# EAGLE design mod.A (EAGLE 7.5.0)
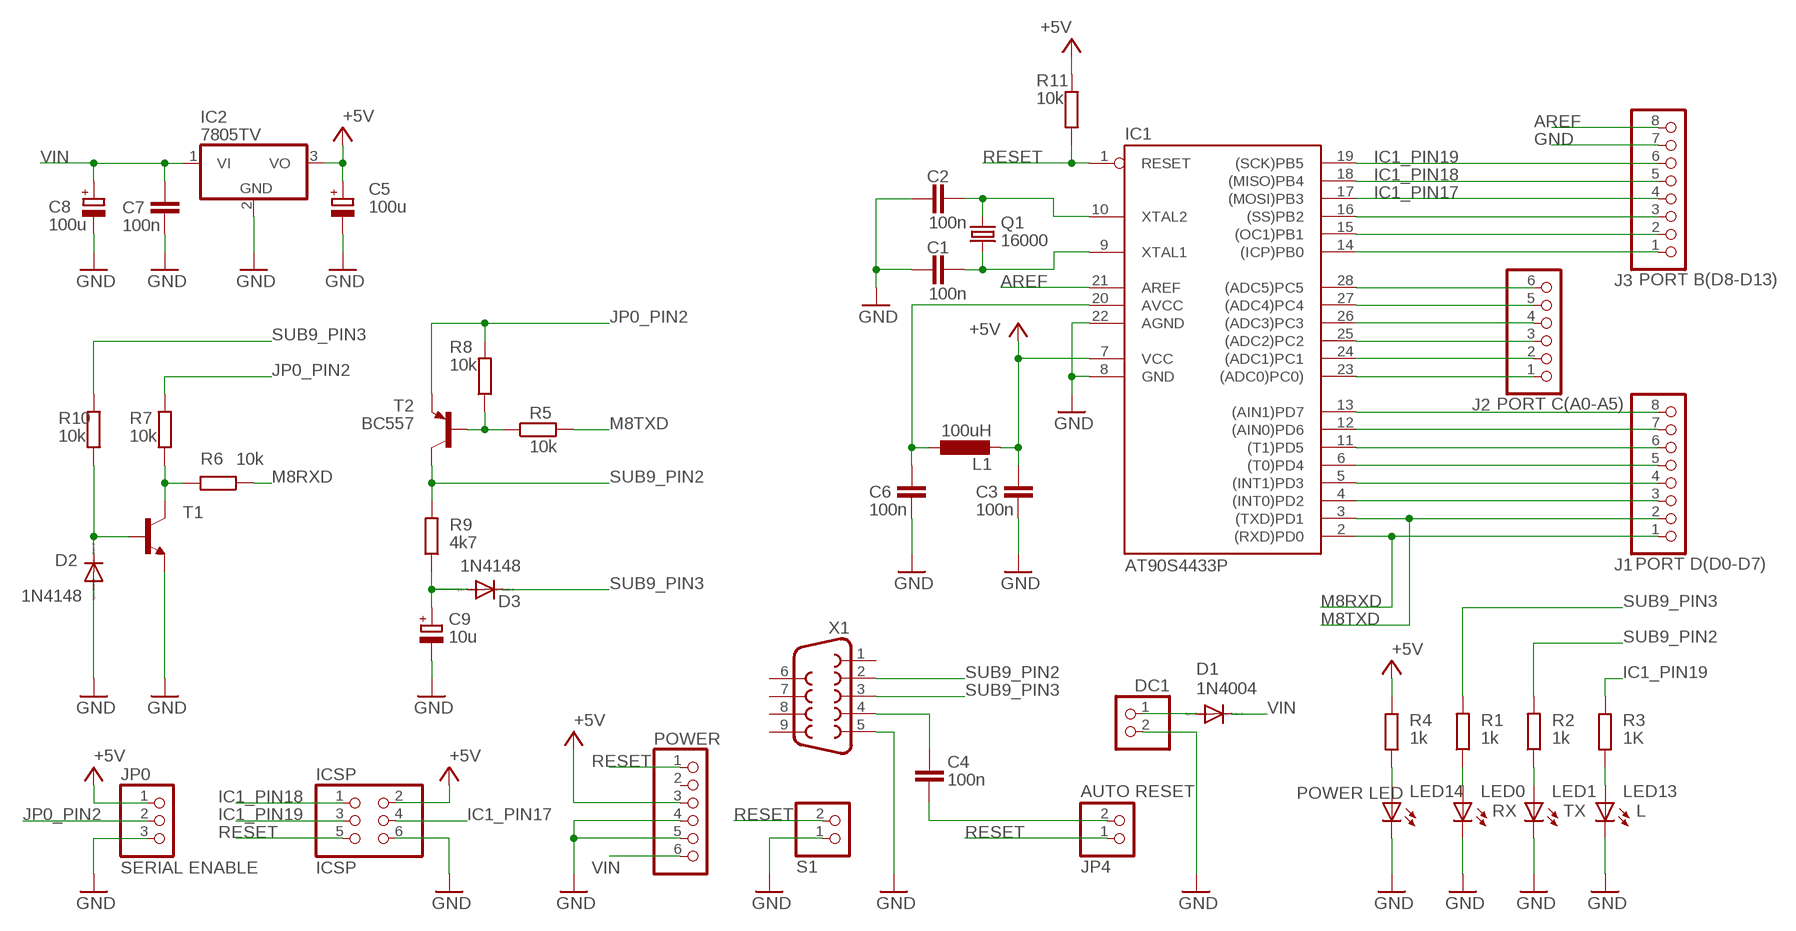
[diagram p0: schematic, sheet 1]

## Parts
C1  100n  C-EUC1206  [C1206]
C2  100n  C-EUC1206  [C1206]
C3  100n  C-EUC1206  [C1206]
C4  100n  C-EUC1206  [C1206]
C5  100u  CPOL-EUE5-8.5  [E5-8,5]
C6  100n  C-EUC1206  [C1206]
C7  100n  C-EUC1206  [C1206]
C8  100u  CPOL-EUE5-8.5  [E5-8,5]
C9  10u  CPOL-EUSMCB  [SMC_B]
D1  1N4004  [DO41-10]
D2  1N4148  1N4148DO35-10  [DO35-10]
D3  1N4148  1N4148DO35-10  [DO35-10]
DC1  PINHD-1X2  [1X02]
IC1  AT90S4433P  [DIL28-3]
IC2  7805TV  [TO220V]
ICSP  ICSP  PINHD-2X3  [2X03]
J1  PORT D(D0-D7)  PINHD-1X8  [1X08]
J2  PORT C(A0-A5)  PINHD-1X6  [1X06]
J3  PORT B(D8-D13)  PINHD-1X8  [1X08]
JP0  SERIAL ENABLE  PINHD-1X3  [1X03]
JP4  AUTO RESET  PINHD-1X2  [1X02]
L1  100uH  L-EUL1812  [L1812]
LED0  RX  LED3MM  [LED3MM]
LED1  TX  LED3MM  [LED3MM]
LED13  L  LED3MM  [LED3MM]
LED14  POWER LED  LED3MM  [LED3MM]
POWER  PINHD-1X6  [1X06]
Q1  16000  CRYSTALHC18U-V  [HC18U-V]
R1  1k  R-EU_R1206  [R1206]
R2  1k  R-EU_R1206  [R1206]
R3  1K  R-EU_R1206  [R1206]
R4  1k  R-EU_R1206  [R1206]
R5  10k  R-EU_R1206  [R1206]
R6  10k  R-EU_R1206  [R1206]
R7  10k  R-EU_R1206  [R1206]
R8  10k  R-EU_R1206  [R1206]
R9  4k7  R-EU_R1206  [R1206]
R10  10k  R-EU_R1206  [R1206]
R11  10k  R-EU_R1206  [R1206]
S1  PINHD-1X2  [1X02]
T1  BC547-NPN-TO92-CBE  [TO92-CBE]
T2  BC557  BC557B-PNP-TO92-EBC  [TO92-EBC]
X1  F09H  [F09H]

## Nets
+5V [POWER]: C3.1 C5.+ IC1.7(VCC) IC2.3(VO) ICSP.2 JP0.1 L1.2 POWER.3 R4.1 R11.2
AREF [GND]: IC1.21(AREF) J3.8
GND [GND]: C1.1 C2.1 C3.2 C5.- C6.2 C7.2 C8.- C9.- D2.A DC1.2 IC1.8(GND) IC1.22(AGND) IC2.2(GND) ICSP.6 J3.7 JP0.3 LED0.K(C) LED1.K(C) LED13.K(C) LED14.K(C) POWER.4 POWER.5 S1.1 T1.E X1.5
IC1_PIN17: IC1.17((MOSI)PB3) ICSP.4 J3.4
IC1_PIN18: IC1.18((MISO)PB4) ICSP.1 J3.5
IC1_PIN19: IC1.19((SCK)PB5) ICSP.3 J3.6 R3.1
JP0_PIN2: JP0.2 R7.2 R8.2 T2.E
M8RXD: IC1.2((RXD)PD0) J1.1 R6.1
M8TXD: IC1.3((TXD)PD1) J1.2 R5.2
N$1: IC1.28((ADC5)PC5) J2.6
N$2: IC1.27((ADC4)PC4) J2.5
N$3: IC1.26((ADC3)PC3) J2.4
N$4: IC1.25((ADC2)PC2) J2.3
N$5: IC1.24((ADC1)PC1) J2.2
N$6: IC1.23((ADC0)PC0)) J2.1
N$7: IC1.13((AIN1)PD7) J1.8
N$8: IC1.12((AIN0)PD6) J1.7
N$9: IC1.11((T1)PD5) J1.6
N$10: IC1.6((T0)PD4) J1.5
N$11: IC1.5((INT1)PD3) J1.4
N$12: IC1.4((INT0)PD2) J1.3
N$13: LED14.A R4.2
N$14: R5.1 R8.1 T2.B
N$15: IC1.14((ICP)PB0) J3.1
N$16: IC1.15((OC1)PB1) J3.2
N$17: IC1.16((SS)PB2) J3.3
N$20: LED13.A R3.2
N$22: C4.1 X1.4
N$23: LED1.A R2.1
N$25: C9.+ D3.A R9.1
N$26 [GND]: D1.A DC1.1
N$27: C4.2 JP4.2
N$28: D2.C R10.1 T1.B
N$29: R6.2 R7.1 T1.C
N$30: LED0.A R1.1
N$31: C1.2 IC1.9(XTAL1) Q1.1
N$32: C2.2 IC1.10(XTAL2) Q1.2
N$33: C6.1 IC1.20(AVCC) L1.1
RESET: IC1.1(RESET) ICSP.5 JP4.1 POWER.1 R11.1 S1.2
SUB9_PIN2: R2.2 R9.2 T2.C X1.2
SUB9_PIN3: D3.C R1.2 R10.2 X1.3
VIN [GND]: C7.1 C8.+ D1.C IC2.1(VI) POWER.6
Unconnected: POWER.2 X1.1 X1.6 X1.7 X1.8 X1.9

## Library data of the parts
C1-C4 C6 C7 = resistor:C-EU: CAPACITOR, European symbol
C5 C8 C9 = resistor:CPOL-EU: POLARIZED CAPACITOR, European symbol
D1 = diode:1N4004: DIODE general purpose rectifier, 1 A
D2 D3 = diode:1N4148: DIODE high speed (Philips)
DC1 JP4 S1 = pinhead:PINHD-1X2: PIN HEADER
IC1 = atmel:AT90S4433: MICROCONTROLLER 4 Kbytes FLASH 128 bytes SRAM 256 bytes EEPROM UART 6-channel 10 bit ADC; OC_FARNELL: unknown; OC_NEWARK: unknown
IC2 = linear:78*: Positive VOLTAGE REGULATOR Source: http://cache.national.com/ds/LM/LM78L05.pdf http://www.fairchildsemi.com/ds/LM/LM7805.pdf
ICSP = pinhead:PINHD-2X3: PIN HEADER
J1 J3 = pinhead:PINHD-1X8: PIN HEADER
J2 POWER = pinhead:PINHD-1X6: PIN HEADER
JP0 = pinhead:PINHD-1X3: PIN HEADER
L1 = resistor:L-EU: INDUCTOR, European symbol
LED0 LED1 LED13 LED14 = led:LED: LED OSRAM: - CHIPLED LG R971, LG N971, LY N971, LG Q971, LY Q971, LO R971, LY R971 LH N974, LH R974 LS Q976, LO Q976, LY Q976 LO Q996 - Hyper CHIPLED LW Q18S LB Q993, LB Q99A, LB R99A - SideLED LS A670, LO A670, LY A670, LG A670, LP A670 LB A673, LV A673, LT A673, LW A673 LH A674 LY A675 LS A676, LA A676, LO A676, LY A676, LW A676 LS A679, LY A679, LG A679 - Hyper Micro SIDELED® LS Y876, LA Y876, LO Y876, LY Y876 LT Y87S - SmartLED LW L88C, LW L88S LB L89C, LB L89S, LG L890 LS L89K, LO L89K, LY L89K LS L896, LA L896, LO L896, LY L896 - TOPLED LS T670, LO T670, LY T670, LG T670, LP T670 LSG T670, LSP T670, LSY T670, LOP T670, LYG T670 LG T671, LOG T671, LSG T671 LB T673, LV T673, LT T673, LW T673 LH T674 LS T676, LA T676, LO T676, LY T676, LB T676, LH T676, LSB T676, LW T676 LB T67C, LV T67C, LT T67C, LS T67K, LO T67K, LY T67K, LW E67C LS E67B, LA E67B, LO E67B, LY E67B, LB E67C, LV E67C, LT E67C LW T67C LS T679, LY T679, LG T679 LS T770, LO T770, LY T770, LG T770, LP T770 LB T773, LV T773, LT T773, LW T773 LH T774 LS E675, LA E675, LY E675, LS T675 LS T776, LA T776, LO T776, LY T776, LB T776 LHGB T686 LT T68C, LB T68C - Hyper Mini TOPLED® LB M676 - Mini TOPLED Santana® LG M470 LS M47K, LO M47K, LY M47K Source: http://www.osram.convergy.de LUXEON: - LUMILED® LXK2-PW12-R00, LXK2-PW12-S00, LXK2-PW14-U00, LXK2-PW14-V00 LXK2-PM12-R00, LXK2-PM12-S00, LXK2-PM14-U00 LXK2-PE12-Q00, LXK2-PE12-R00, LXK2-PE12-S00, LXK2-PE14-T00, LXK2-PE14-U00 LXK2-PB12-K00, LXK2-PB12-L00, LXK2-PB12-M00, LXK2-PB14-N00, LXK2-PB14-P00, LXK2-PB14-Q00 LXK2-PR12-L00, LXK2-PR12-M00, LXK2-PR14-Q00, LXK2-PR14-R00 LXK2-PD12-Q00, LXK2-PD12-R00, LXK2-PD12-S00 LXK2-PH12-R00, LXK2-PH12-S00 LXK2-PL12-P00, LXK2-PL12-Q00, LXK2-PL12-R00 Source: www.luxeon.com KINGBRIGHT: KA-3528ASYC Source: www.kingbright.com
Q1 = crystal:CRYSTAL: CRYSTAL; OC_FARNELL: unknown; OC_NEWARK: unknown
R1-R11 = resistor:R-EU_: RESISTOR, European symbol
T1 = transistor:*-NPN-: NPN Transistror BF959 corrected 2008.03.06
T2 = transistor:*-PNP-: PNP Transistror
X1 = con-subd:F09: SUB-D; OC_FARNELL: unknown; OC_NEWARK: unknown

## Net classes
1 GND: width 0.61 mm, clearance 0.61 mm
2 POWER: width 0.406 mm, clearance 0.406 mm

## Board
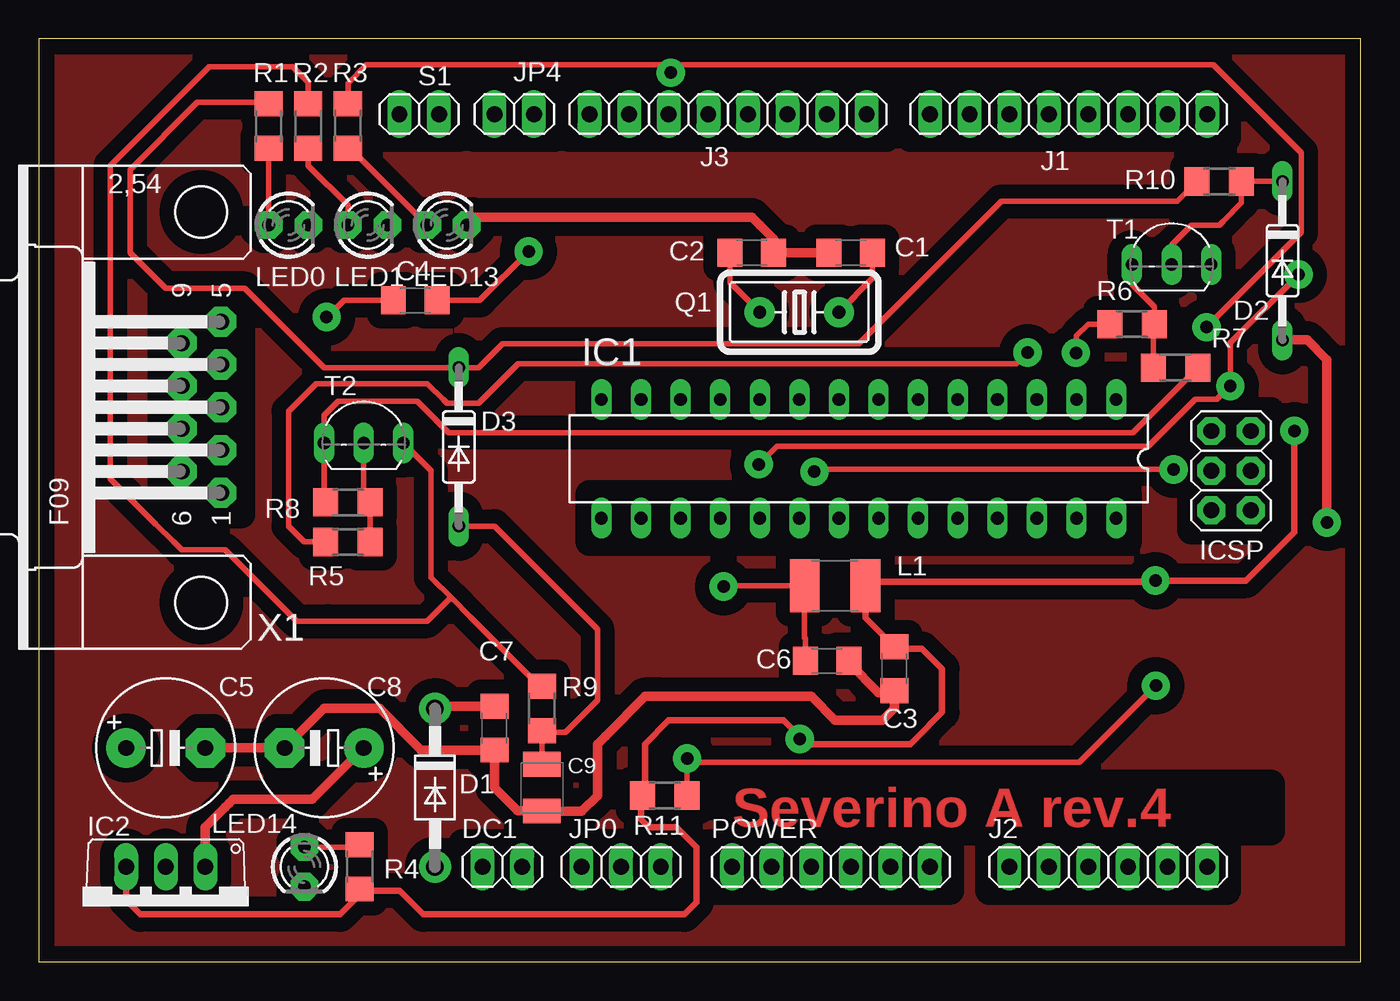
[diagram p1: board, top side]
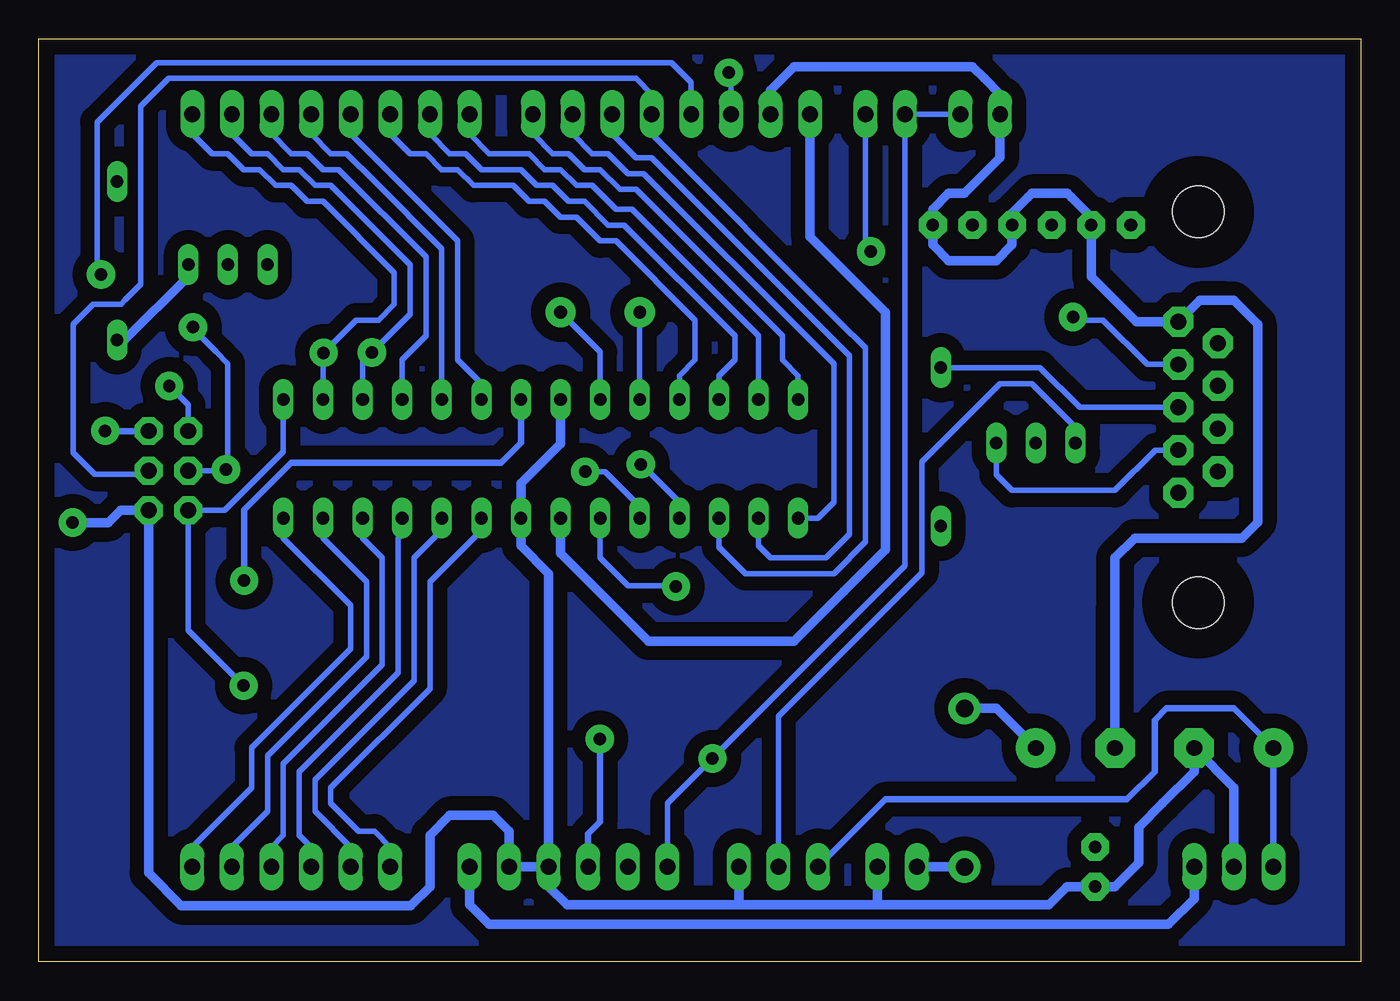
[diagram p2: board, bottom side, seen from below]

Size 84.76 x 59.17 mm. Coordinates in mm from the lower left corner, seen from the top.
Outline: 0,0 84.76,0 84.76,59.17 0,59.17 0,0
Copper layers (1*16): Top 0.035mm / dielectric 1.5mm / Bottom 0.035mm
Design rules "reglasDisFabLab *": minimum track width 14mil, minimum drill 0.799996875mm, track to track 12mil, track to pad 12mil, pad to pad 12mil, via to via 12mil, smd to smd 8mil, copper to edge 40mil, drill to drill 8mil, minimum pad ring 10mil, minimum via ring 20mil, stop-mask expansion 4mil, vias tented up to drill 0mil, thermal gap 10mil
tRestrict: area 55.9,52.8 to 76.2,55.9; area 34,52.8 to 54.4,55.9; area 27.9,52.8 to 33,55.9; area 21.8,52.8 to 26.9,55.9; area 61,4.6 to 76.2,7.6; area 43.2,4.6 to 58.4,7.6; area 33.5,4.6 to 41.1,7.6; area 27.2,4.6 to 32.3,7.6; area 73.9,27.7 to 79,35.3; area 35.3,34.5 to 69.8,37.6; area 35.3,26.9 to 69.8,30; area 7.9,28.7 to 13,42.4; 1 more areas

### Footprints (pad centres in the part's own frame; a part is rotated, then mirrored left to right if it is on the bottom)
C1206 = smd 1.6 x 1.8: 1 -1.4,0; 2 1.4,0
E5-8,5 = drill 1.016 pad 2.54: + -2.54,0 | drill 1.016 pad 2.54 octagon: - 2.54,0
SMC_B = smd 1.6 x 2.4: + -1.5,0; - 1.5,0
DO41-10 = drill 1.118 pad 2.032: A 5.08,0; C -5.08,0
DO35-10 = drill 0.813 long: A 5.08,0; C -5.08,0
1X02 = drill 1.016 long: 1 -1.27,0; 2 1.27,0
DIL28-3 = drill 0.813 long: 1 -16.51,-3.81; 2 -13.97,-3.81; 3 -11.43,-3.81; 4 -8.89,-3.81; 5 -6.35,-3.81; 6 -3.81,-3.81; 7 -1.27,-3.81; 8 1.27,-3.81; 9 3.81,-3.81; 10 6.35,-3.81; 11 8.89,-3.81; 12 11.43,-3.81; 13 13.97,-3.81; 14 16.51,-3.81; 15 16.51,3.81; 16 13.97,3.81; 17 11.43,3.81; 18 8.89,3.81; 19 6.35,3.81; 20 3.81,3.81; 21 1.27,3.81; 22 -1.27,3.81; 23 -3.81,3.81; 24 -6.35,3.81; 25 -8.89,3.81; 26 -11.43,3.81; 27 -13.97,3.81; 28 -16.51,3.81
TO220V = drill 1.016 long: 1 -2.54,-2.54; 2 0,-2.54; 3 2.54,-2.54
2X03 = drill 1.016 pad 1.778 octagon: 1 -2.54,-1.27; 2 -2.54,1.27; 3 0,-1.27; 4 0,1.27; 5 2.54,-1.27; 6 2.54,1.27
1X08 = drill 1.016 long: 1 -8.89,0; 2 -6.35,0; 3 -3.81,0; 4 -1.27,0; 5 1.27,0; 6 3.81,0; 7 6.35,0; 8 8.89,0
1X06 = drill 1.016 long: 1 -6.35,0; 2 -3.81,0; 3 -1.27,0; 4 1.27,0; 5 3.81,0; 6 6.35,0
1X03 = drill 1.016 long: 1 -2.54,0; 2 0,0; 3 2.54,0
L1812 = smd 1.9 x 3.4: 1 -1.95,0; 2 1.95,0
LED3MM = drill 0.813 pad 1.778 octagon: A -1.27,0; K 1.27,0
HC18U-V = drill 0.813 pad 1.93: 1 -2.54,0; 2 2.54,0
R1206 = smd 1.6 x 1.803: 1 -1.422,0; 2 1.422,0
TO92-CBE = drill 0.813 long: B 0,0; C -2.54,0; E 2.54,0
TO92-EBC = drill 0.813 long: B 0,-1.27; C 2.54,-1.27; E -2.54,-1.27
F09H = drill 1.016 pad 1.93 octagon: 1 -5.486,-1.27; 2 -2.743,-1.27; 3 0,-1.27; 4 2.743,-1.27; 5 5.486,-1.27; 6 -4.115,1.27; 7 -1.372,1.27; 8 1.372,1.27; 9 4.115,1.27 | hole 3.302: -12.522,0; 12.522,0

### Placement (x,y rotation side)
C1  52.07,45.47 0 top
C2  45.72,45.47 180 top
C3  54.86,18.8 270 top
C4  24.13,42.42 0 top
C5  8.13,13.72 0 top
C6  50.55,19.3 0 top
C7  29.21,14.99 270 top
C8  18.29,13.72 180 top
C9  32.26,11.18 270 top
D1  25.4,11.18 270 top
D2  79.76,44.96 270 top
D3  26.92,33.02 270 top
DC1  29.72,6.1 0 top
IC1  52.58,32.26 180 top
IC2  8.13,3.56 180 top
ICSP  76.45,31.5 270 top
J1  66.04,54.36 180 top
J2  68.58,6.1 0 top
J3  44.2,54.36 180 top
JP0  37.34,6.1 0 top
JP4  30.48,54.36 0 top
L1  51.05,24.13 0 top
LED0  16,47.24 0 top
LED1  21.08,47.24 0 top
LED13  26.16,47.24 0 top
LED14  17.02,6.1 270 top
POWER  50.8,6.1 0 top
Q1  48.77,41.66 180 top
R1  14.73,53.59 90 top
R2  17.27,53.59 90 top
R3  19.81,53.59 270 top
R4  20.57,6.1 90 top
R5  19.81,26.92 180 top
R6  70.1,40.89 0 top
R7  72.9,38.1 0 top
R8  19.81,29.46 180 top
R9  32.26,16.26 90 top
R10  75.69,50.04 180 top
R11  40.13,10.67 180 top
S1  24.38,54.36 0 top
T1  72.64,44.7 0 top
T2  20.83,34.54 0 top
X1  10.41,35.56 90 top

### Tracks (layer width: path | path; a pad name or v marks a point on that pad's centre or on a via)
+5V  (via drill 0.8 pad 1.82)
  Top 0.406: v80.51,34.05 80.51,28.27 80.51,27.55 80.39,27.43 77.41,24.45 v71.6,24.45 71.54,24.38 53.59,24.38 53.34,24.13 L1.2 53,22.06 C3.1 54.99,20.07 56.64,20.07 57.91,18.8 57.91,16 56.2,14.29 55.88,13.97 49.11,13.97 v48.79,14.29 48.79,14.46 47.75,15.49 40.39,15.49 38.86,13.97 38.86,10.57 R11.2 38.61,10.31 38.61,9.14 39.12,8.64 40.89,8.64 42.16,7.37 42.16,3.81 41.4,3.05 24.64,3.05 23.11,4.57 20.68,4.57 R4.1 20.57,4.32 19.3,3.05 6.5,3.05 6.48,3.08 5.59,3.96 IC2.3
  Bottom 0.406: POWER.3 49.53,8.23 48.79,8.97 v48.79,14.29 | ICSP.2 80.53,34.04 v80.51,34.05 | v71.6,24.45 71.6,28.4 71.6,28.98 68.58,32 55.12,32 53.85,33.27 IC1.7 | IC2.3 C5.+ 7.67,15.8 8.13,16.26 12.45,16.26 13.21,15.49 13.21,12.19 14.99,10.41 30.48,10.41 31.88,9.02 | 31.74,9.15 31.88,9.02 | 31.88,9.02 JP0.1
AREF
  Bottom 0.61: IC1.21 51.31,26.21 45.67,20.57 36.32,20.57 33.13,23.77 30.48,26.42 30.48,29.07 30.48,41.66 35.31,46.48 J3.8
GND  (via drill 0.8 pad 1.82)
  Top 0.61: D2.A 81.33,39.88 82.6,38.61 v82.6,28.17 | C5.- C8.- 18.29,16.26 21.84,16.26 24.51,13.59 C7.2 29.21,11.18 30.71,9.68 C9.- | C1.1 C2.1 47.12,46.37 47.1,46.37 46.23,47.24 45.72,47.75 27.94,47.75 LED13.K | C9.- 32.87,9.68 | C6.2 51.95,19.17 53.85,17.27 54.74,17.27 C3.2 54.86,16.26 54.1,15.49 51.05,15.49 49.53,17.02 39.88,17.02 38.86,17.02 36.32,14.48 35.81,13.97 35.81,10.67 34.8,9.65 32.28,9.65 C9.-
  Bottom 0.61: IC1.8 51.31,33.22 53.85,30.68 IC1.22 53.85,26.67 52.07,24.89 POWER.4 | v82.6,28.17 80.31,28.17 79.53,28.96 ICSP.6 77.72,5.7 75.63,3.61 60.91,3.61 59.69,4.83 59.69,8.13 58.42,9.4 55.63,9.4 54.61,8.38 54.61,7.37 POWER.5 POWER.4 | C8.- 15.75,22.84 15.75,25.91 14.48,27.18 7.62,27.18 6.6,28.19 6.6,40.89 8.13,42.42 8.64,42.42 10.31,42.42 X1.5 14.38,41.05 17.27,43.94 17.27,45.44 LED0.K 17.27,47.75 18.54,49.02 18.8,49.28 21.08,49.28 21.34,49.02 22.35,48.01 LED1.K 22.35,45.97 23.37,44.96 26.42,44.96 27.43,45.97 27.43,46.74 | 39.88,3.66 30.99,3.66 | DC1.2 30.99,3.66 | 30.99,3.66 19.99,3.66 18.82,4.83 LED14.K 15.75,4.83 14.22,6.35 14.22,8.64 12.7,10.16 10.67,12.19 C5.- | IC2.2 8.13,8.53 8.13,11.18 C5.- | 27.43,46.74 LED13.K | C5.- 10.92,13.72 | 39.88,3.66 50.9,3.66 52.07,4.83 POWER.4 | JP0.3 39.88,3.66 | J3.7 37.85,55.88 36.32,57.4 24.89,57.4 24.13,56.64 23.11,55.63 S1.1 23.11,51.56 25.4,49.28 26.42,49.28 27.43,48.26 27.43,46.74 | D2.A 79.25,39.88 75.18,43.94 T1.E
IC1_PIN17
  Bottom 0.356: IC1.17 41.15,26.59 39.45,24.89 33.78,24.89 31.75,26.92 31.75,39.37 33.41,41.03 45.47,53.09 J3.4 45.47,54.58 45.47,55.63 46.48,56.64 75.44,56.64 76.45,56.64 78.23,54.86 78.23,53.85 78.23,44.08 78.23,43.43 79.25,42.42 79.5,42.16 81.28,42.16 82.55,40.89 82.55,32.63 82.52,32.6 81.2,31.28 78.09,31.28 77.88,31.5 ICSP.4
IC1_PIN18  (via drill 0.8 pad 1.82)
  Top 0.356: v80.78,44.07 76.41,39.7 v76.41,36.93 75.62,36.14 | 75.62,36.14 75.55,36.07 | v46.16,31.9 47.32,33.07 70.7,33.07 71.17,33.07 74.17,36.07 75.55,36.07 75.62,36.14
  Bottom 0.356: 80.95,44.24 v80.78,44.07 81.03,44.31 81.03,53.85 77.47,57.4 77.22,57.66 44.2,57.66 43.94,57.4 42.93,56.39 J3.5 | v76.41,36.93 75.18,35.71 ICSP.1 | v46.16,31.9 46.13,31.9 43.69,29.46 IC1.18
IC1_PIN19  (via drill 0.8 pad 1.82)
  Top 0.356: v74.88,40.7 80.95,46.77 80.95,51.88 75.32,57.52 40.78,57.52 v40.52,57.01 40.27,57.52 20.98,57.52 19.81,56.35 R3.1 | v72.78,31.57 49.88,31.57 v49.73,31.43
  Bottom 0.356: 72.29,31.59 v72.78,31.57 | v40.52,57.01 40.39,57.41 J3.6 | ICSP.3 72.35,31.5 v72.78,31.57 | v74.88,40.7 74.88,40.59 73.41,39.12 72.64,38.35 72.64,31.71 v72.78,31.57 | v49.73,31.43 48.45,31.43 46.23,29.21 IC1.19
JP0_PIN2
  Top 0.356: R7.2 70.16,33.94 70,33.94 27.93,33.94 26.26,33.94 24.26,35.94 19.18,35.94 18.29,35.05 18.29,34.29 T2.E 18.29,29.57 R8.2
  Bottom 0.356: JP0.2 37.34,7.87 | 37.34,7.87 37.34,8.15 | T2.E 18.29,34.29 21.08,37.08 23.11,37.08 23.91,36.28 28.13,32.07 28.13,30.93 28.13,24.95 37.34,15.75 37.34,7.87
M8RXD  (via drill 0.8 pad 1.82)
  Top 0.356: R6.1 67.31,40.89 66.55,40.13 66.55,39.09 v66.51,39.05
  Bottom 0.356: IC1.2 66.55,39.01 v66.51,39.05 | 66.55,39.09 v66.51,39.05 | J1.1 74.93,53.09 73.66,51.82 72.64,51.82 71.63,50.8 70.61,50.8 69.6,49.78 68.58,49.78 67.56,48.77 66.55,48.77 61.98,44.2 61.98,42.16 62.99,41.15 64.41,41.15 64.92,40.64 v66.51,39.05
M8TXD  (via drill 0.8 pad 1.82)
  Top 0.356: R5.2 17.02,26.92 16,27.94 16,35.31 17.06,36.36 17.78,37.08 24.89,37.08 25.91,36.07 26.16,35.81 28.19,35.81 30.73,38.35 62.7,38.35 v63.42,39.07
  Bottom 0.356: IC1.3 64.01,37.92 64.01,38.48 v63.42,39.07 | J1.2 72.39,53.09 71.12,51.82 70.1,51.82 69.09,50.8 68.07,50.8 67.06,49.78 66.04,49.78 60.96,44.7 60.96,41.53 v63.42,39.07 | 63.21,38.86 v63.42,39.07
N$1
  Bottom 0.356: 73.41,8.89 73.53,8.76 | 73.53,8.76 74.93,7.37 J2.6 | 73.53,8.76 71.12,11.18 71.12,13.72 64.77,20.07 64.77,22.86 69.09,27.18 IC1.28
N$2
  Bottom 0.356: J2.5 72.39,7.37 70.1,9.65 70.1,13.21 64.01,19.3 63.75,19.56 63.75,24.38 66.55,27.18 IC1.27
N$3
  Bottom 0.356: J2.4 69.85,7.37 69.09,8.13 69.09,12.7 62.74,19.05 62.74,24.89 62.74,25.91 64.01,27.18 IC1.26
N$4
  Bottom 0.356: J2.3 67.31,7.37 68.07,8.13 68.07,12.19 61.72,18.54 61.72,24.89 61.72,27.18 61.47,27.43 IC1.25
N$5
  Bottom 0.356: J2.2 64.77,7.37 67.06,9.65 67.06,11.68 60.71,18.03 60.71,24.89 60.71,25.91 58.93,27.69 IC1.24
N$6
  Bottom 0.356: IC1.23 56.39,27.69 59.69,24.38 59.69,17.53 66.04,11.18 66.04,10.16 64.26,8.38 63.25,8.38 62.23,7.37 J2.1
N$7
  Bottom 0.356: J1.8 57.15,53.09 55.88,51.82 53.34,51.82 52.32,50.8 51.31,50.8 50.29,49.78 49.28,49.78 47.75,48.26 46.74,48.26 38.61,40.13 38.61,36.32 IC1.13
N$8
  Bottom 0.356: IC1.12 41.15,37.59 40.13,38.61 40.13,40.13 47.24,47.24 48.26,47.24 49.78,48.77 50.8,48.77 51.82,49.78 52.83,49.78 53.85,50.8 56.39,50.8 57.4,51.82 58.42,51.82 59.69,53.09 J1.7
N$9
  Bottom 0.356: IC1.11 43.69,37.59 42.67,38.61 42.67,40.89 42.67,41.15 47.75,46.23 48.77,46.23 50.29,47.75 51.31,47.75 52.32,48.77 53.34,48.77 54.36,49.78 56.9,49.78 57.91,50.8 58.93,50.8 59.94,51.82 60.96,51.82 62.23,53.09 J1.6
N$10
  Bottom 0.356: J1.5 64.77,53.09 57.91,46.23 57.91,38.61 56.39,37.08 IC1.6
N$11
  Bottom 0.356: J1.4 67.31,53.09 66.04,51.82 65.02,51.82 63.25,50.04 58.93,45.72 58.93,40.64 58.93,37.08 IC1.5
N$12
  Bottom 0.356: J1.3 69.85,53.09 68.58,51.82 67.56,51.82 66.55,50.8 65.53,50.8 59.94,45.21 59.94,41.15 59.94,40.13 61.47,38.61 IC1.4
N$13
  Top 0.356: LED14.A 20.42,7.37 R4.2
N$14
  Top 0.356: R5.1 R8.1 20.83,29.87 T2.B
N$15
  Bottom 0.356: J3.1 53.09,53.09 51.82,51.82 50.8,51.82 49.78,50.8 48.77,50.8 47.5,49.53 46.48,49.53 37.08,40.13 37.08,38.61 36.07,37.59 IC1.14
N$16
  Bottom 0.356: J3.2 50.55,53.09 49.28,51.82 48.26,51.82 46.99,50.55 45.97,50.55 34.87,39.44 33.78,38.35 33.78,29.46 34.8,28.45 IC1.15
N$17
  Bottom 0.356: IC1.16 38.61,27.43 38.61,26.67 37.85,25.91 34.29,25.91 32.77,27.43 32.77,38.86 34.15,40.25 45.47,51.56 46.48,51.56 48.01,53.09 J3.3
N$18
  pour Bottom (isolate 0.914): 0,59.18 84.84,59.18 84.84,0 -0.51,-0.51
N$19
  pour Top (isolate 0.914): 0,59.18 84.84,59.18 84.84,0 0,0
N$20
  Top 0.356: R3.2 19.96,52.17 LED13.A
N$22  (via drill 0.8 pad 1.82)
  Top 0.356: v18.45,41.34 18.48,41.34 19.56,42.42 C4.1
  Bottom 0.356: X1.4 13.66,38.3 16.51,41.15 18.25,41.15 v18.45,41.34
N$23
  Top 0.356: R2.1 17.27,51.05 19.81,48.51 LED1.A
N$25
  Top 0.356: C9.+ R9.1 32.36,14.73 33.78,14.73 35.81,16.76 35.81,21.34 29.21,27.94 D3.A
N$26
  Bottom 0.61: DC1.1 D1.A
N$27  (via drill 0.8 pad 1.82)
  Top 0.356: C4.2 28.27,42.42 v31.4,45.55
  Bottom 0.356: JP4.2 31.75,45.89 v31.4,45.55
N$28
  Top 0.356: D2.C 78.38,50.04 R10.1 77.11,48.67 75.95,47.5 75.69,47.24 73.91,47.24 72.64,45.97 T1.B
N$29
  Top 0.356: R7.1 71.48,40.84 R6.2 71.53,42.01 70.1,43.43 T1.C
N$30
  Top 0.356: R1.1 LED0.A
N$31
  Top 0.356: C1.2 53.47,43.82 Q1.1
  Bottom 0.356: IC1.9 48.77,39.12 Q1.1
N$32
  Top 0.356: C2.2 44.32,43.56 Q1.2
  Bottom 0.356: Q1.2 IC1.10
N$33  (via drill 0.8 pad 1.82)
  Top 0.356: C6.1 49.15,20.74 49.1,20.78 L1.1 43.97,24.13 v43.9,24.06
  Bottom 0.356: IC1.20 48.77,25.91 46.99,24.13 43.97,24.13 v43.9,24.06
N$34  (via drill 0.5)
  other vias: -10.16,59.44
N$35  (via drill 0.5)
  other vias: 95,0
RESET  (via drill 0.8 pad 1.82)
  Top 0.356: 41.57,12.79 v41.57,13.04 41.55,13.03 R11.1 | 41.57,12.79 61.63,12.79 66.71,12.79 v71.64,17.71 | 41.57,12.79 41.57,12.71
  Bottom 0.356: S1.2 JP4.1 29.21,25.4 v41.57,13.04 44.45,10.16 44.45,8.15 POWER.1 | IC1.1 69.09,34.21 69.09,32.72 72.85,28.96 73.76,28.96 74.39,28.96 ICSP.5 75.18,21.26 v71.64,17.71
SUB9_PIN2
  Top 0.356: R9.2 32.11,17.68 27.69,22.1 26.42,23.37 | 26.42,23.37 25.15,24.64 25.15,31.5 T2.C | 7.29,28.27 7.49,28.07 | 7.49,28.07 8.64,26.92 9.14,26.42 11.94,26.42 16.51,21.84 18.54,21.84 24.89,21.84 26.42,23.37 | R2.2 17.27,56.39 16.26,57.4 10.92,57.4 4.57,51.05 4.57,30.99 7.49,28.07
  Bottom 0.356: X1.2 13.16,32.82 15.75,30.23 22.35,30.23 23.37,31.24 T2.C
SUB9_PIN3
  Top 0.356: R10.2 73,48.77 62.31,48.77 61.72,48.77 52.58,39.62 29.72,39.62 29.46,39.37 28.19,38.1 28.12,38.1 D3.C 25.73,38.1 25.65,38.1 18.29,38.1 13.21,43.18 8.13,43.18 5.84,45.47 5.84,50.8 10.16,55.12 14.63,55.12 R1.2
  Bottom 0.356: D3.C 20.55,38.1 18.01,35.56 13.18,35.56 X1.3
VIN
  Top 0.61: C7.1 25.53,16.39 D1.C | IC2.1 10.67,8.38 10.67,8.64 11.94,9.91 12.19,10.16 12.45,10.41 17.53,10.41 C8.+
  Bottom 0.61: POWER.6 57.15,3.66 55.9,2.41 15.82,2.41 12.32,2.41 10.67,4.06 IC2.1 | D1.C 23.37,16.26 C8.+

### Text on the board
Top: Severino A rev.4